# Altium schematic sheet CM5IO.SchDoc
size 297 x 209 mm
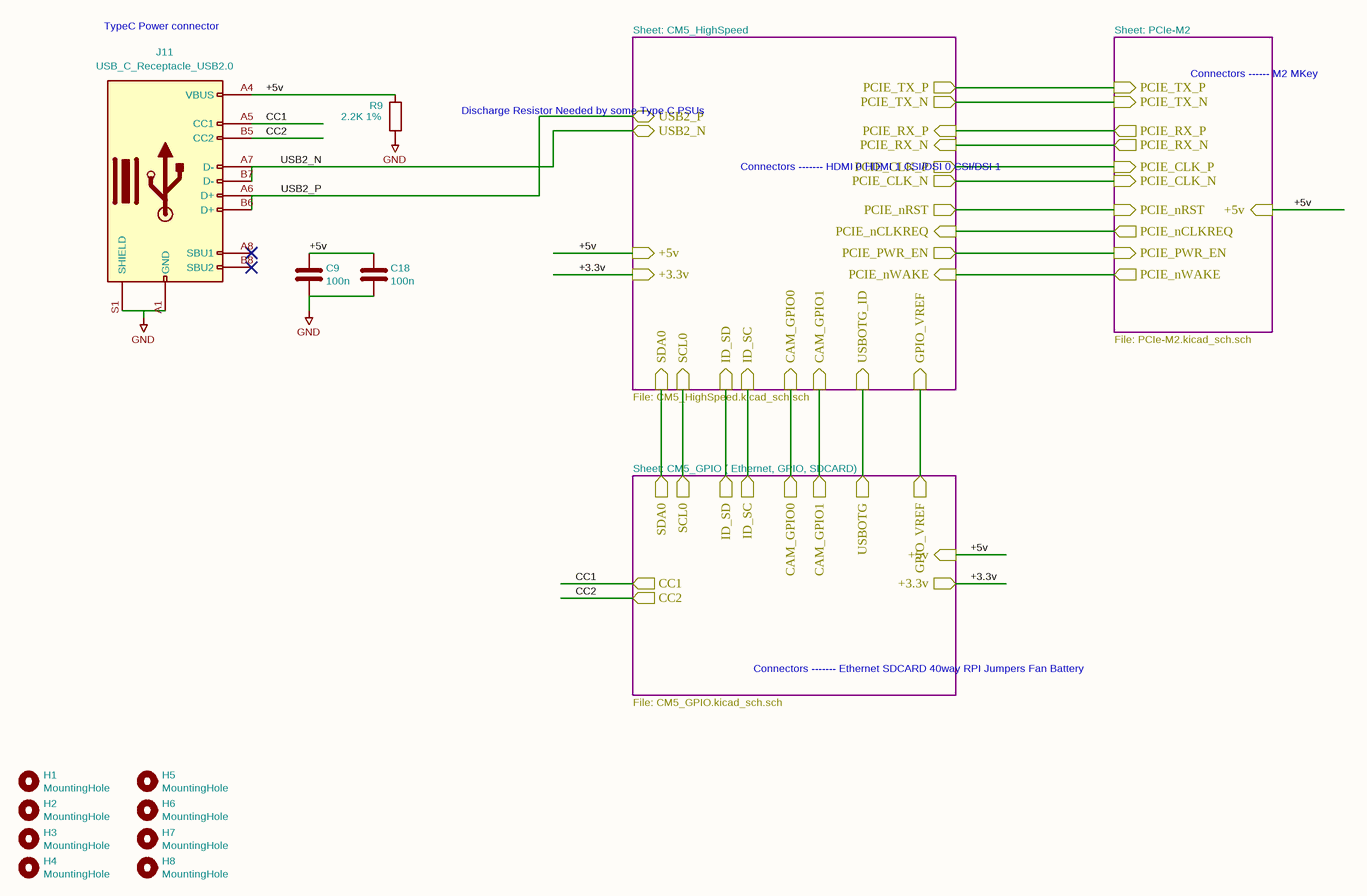
[diagram p0: CM5IO.SchDoc]

## Parts
C9  100n  [C_0402_1005Metric]
C18  100n  [C_0402_1005Metric]
H1  MountingHole  [MountingHole_2.7mm_M2.5_DIN965]
H2  MountingHole  [MountingHole_2.7mm_M2.5_DIN965]
H3  MountingHole  [MountingHole_2.7mm_M2.5_DIN965]
H4  MountingHole  [MountingHole_2.7mm_M2.5_DIN965]
H5  MountingHole  [MountingHole_2.7mm_M2.5_DIN965]
H6  MountingHole  [MountingHole_2.7mm_M2.5_DIN965]
H7  MountingHole  [MountingHole_2.7mm_M2.5_DIN965]
H8  MountingHole  [MountingHole_2.7mm_M2.5_DIN965]
J11  USB_C_Receptacle_USB2.0  [USB_C_Receptacle_GCT_USB4105-xx-A_16P_TopMnt_Horizontal]
R9  2.2K 1%  [R_0402_1005Metric]

## Sub-sheets
CM5_GPIO ( Ethernet, GPIO, SDCARD) = CM5_GPIO.SchDoc: ID_SC (out), ID_SD (out), SCL0 (out), SDA0 (out), +5v (in), +3.3v (out), GPIO_VREF (out), CAM_GPIO0 (out), CAM_GPIO1 (out), CC1 (out), USBOTG (out), CC2 (out)
CM5_HighSpeed = CM5_HighSpeed.SchDoc: USB2_N (bidir), USB2_P (bidir), ID_SC (in), ID_SD (in), SCL0 (in), SDA0 (in), +5v (in), PCIE_CLK_P (out), PCIE_CLK_N (out), PCIE_TX_P (out), PCIE_TX_N (out), PCIE_nRST (out), PCIE_RX_P (in), PCIE_RX_N (in), PCIE_nCLKREQ (in), +3.3v (in), USBOTG_ID (in), GPIO_VREF (in), PCIE_PWR_EN (out), PCIE_nWAKE (in), CAM_GPIO0 (in), CAM_GPIO1 (in)
PCIe-M2 = PCIe-M2.SchDoc: PCIE_CLK_P (in), PCIE_CLK_N (in), PCIE_TX_P (in), PCIE_TX_N (in), PCIE_nCLKREQ (out), PCIE_nRST (in), PCIE_RX_P (out), PCIE_RX_N (out), +5v (in), PCIE_PWR_EN (in), PCIE_nWAKE (out)

## Nets
GND: C9.2 C18.2 J11.A1(GND) J11.S1(SHIELD) R9.2
+3.3v: sheet CM5_GPIO ( Ethernet, GPIO, SDCARD)/+3.3v, sheet CM5_HighSpeed/+3.3v
+5v: C9.1 C18.1 J11.A4(VBUS) R9.1 ; sheet CM5_GPIO ( Ethernet, GPIO, SDCARD)/+5v, sheet CM5_HighSpeed/+5v, sheet PCIe-M2/+5v
CC1: J11.A5(CC1) ; sheet CM5_GPIO ( Ethernet, GPIO, SDCARD)/CC1
CC2: J11.B5(CC2) ; sheet CM5_GPIO ( Ethernet, GPIO, SDCARD)/CC2
USB2_N: J11.A7(D-) J11.B7(D-) ; sheet CM5_HighSpeed/USB2_N
USB2_P: J11.A6(D+) J11.B6(D+) ; sheet CM5_HighSpeed/USB2_P
(unnamed): sheet CM5_GPIO ( Ethernet, GPIO, SDCARD)/ID_SC, sheet CM5_HighSpeed/ID_SC
(unnamed): sheet CM5_GPIO ( Ethernet, GPIO, SDCARD)/ID_SD, sheet CM5_HighSpeed/ID_SD
(unnamed): sheet CM5_GPIO ( Ethernet, GPIO, SDCARD)/SCL0, sheet CM5_HighSpeed/SCL0
(unnamed): sheet CM5_GPIO ( Ethernet, GPIO, SDCARD)/SDA0, sheet CM5_HighSpeed/SDA0
(unnamed): sheet CM5_GPIO ( Ethernet, GPIO, SDCARD)/GPIO_VREF, sheet CM5_HighSpeed/GPIO_VREF
(unnamed): sheet CM5_GPIO ( Ethernet, GPIO, SDCARD)/CAM_GPIO0, sheet CM5_HighSpeed/CAM_GPIO0
(unnamed): sheet CM5_GPIO ( Ethernet, GPIO, SDCARD)/CAM_GPIO1, sheet CM5_HighSpeed/CAM_GPIO1
(unnamed): sheet CM5_GPIO ( Ethernet, GPIO, SDCARD)/USBOTG, sheet CM5_HighSpeed/USBOTG_ID
(unnamed): sheet CM5_HighSpeed/PCIE_CLK_P, sheet PCIe-M2/PCIE_CLK_P
(unnamed): sheet CM5_HighSpeed/PCIE_CLK_N, sheet PCIe-M2/PCIE_CLK_N
(unnamed): sheet CM5_HighSpeed/PCIE_TX_P, sheet PCIe-M2/PCIE_TX_P
(unnamed): sheet CM5_HighSpeed/PCIE_TX_N, sheet PCIe-M2/PCIE_TX_N
(unnamed): sheet CM5_HighSpeed/PCIE_nRST, sheet PCIe-M2/PCIE_nRST
(unnamed): sheet CM5_HighSpeed/PCIE_RX_P, sheet PCIe-M2/PCIE_RX_P
(unnamed): sheet CM5_HighSpeed/PCIE_RX_N, sheet PCIe-M2/PCIE_RX_N
(unnamed): sheet CM5_HighSpeed/PCIE_nCLKREQ, sheet PCIe-M2/PCIE_nCLKREQ
(unnamed): sheet CM5_HighSpeed/PCIE_PWR_EN, sheet PCIe-M2/PCIE_PWR_EN
(unnamed): sheet CM5_HighSpeed/PCIE_nWAKE, sheet PCIe-M2/PCIE_nWAKE

Not connected (* = marked no-connect by the designer): J11 A8(SBU1)* A9(VBUS) A12(GND) B1(GND) B4(VBUS) B8(SBU2)* B9(VBUS) B12(GND)

## Notes on the sheet
- TypeC Power connector
- Sheet: CM5_HighSpeed
- Sheet: PCIe-M2
- Discharge Resistor
  Needed by some
  Type C PSUs
- Connectors
  ------
  M2 MKey
- Connectors
  -------
  HDMI 0
  HDMI 1
  CSI/DSI 0
  CSI/DSI 1
- File: PCIe-M2.kicad_sch.sch
- File: CM5_HighSpeed.kicad_sch.sch
- Sheet: CM5_GPIO ( Ethernet, GPIO, SDCARD)
- File: CM5_GPIO.kicad_sch.sch
- Connectors
  -------
  Ethernet
  SDCARD
  40way RPI
  Jumpers
  Fan
  Battery
- 1
- 2
- 3
- 4
- 5
- 6
- A
- B
- C
- www.raspberrypi.com <http://www.raspberrypi.com>
- D
- Title: Compute Module 5 IO Board - Top Level
- File: CM5IO.kicad_sch
- Sheet: /
- Copyright © 2024 Raspberry Pi Ltd.
- KiCad E.D.A.  kicad (5.1.4)-1
- Size: A4
- Date:
- Rev: 1
- Id: 1/1

## Library data of the parts
C9 C18 = C: Part Description: 0.1uF 10% 16V Ceramic Capacitor X7R 0402 (1005 Metric); Field4: Farnell; Field5: 2611911; Field6: RM EMK105 B7104KV-F; Field7: TAIYO YUDEN EUROPE GMBH; Field8: 110091611; Value: 100n; Footprint: Capacitor_SMD:C_0402_1005Metric
H1-H8 = MountingHole: Part Description: M2.5 mounting hole; Field4: nf; Field5: nf; Field6: nf; Field7: nf; Value: MountingHole; Footprint: CM5IO:MountingHole_2.7mm_M2.5_DIN965
J11 = USB_C_Receptacle_USB2.0_16P: Part Description: USBC USB2 data and power connector; Field5: USBF31-0171; Field7: MTCONN; Field6: USBF31-0171; Value: USB_C_Receptacle_USB2.0; Footprint: Connector_USB:USB_C_Receptacle_GCT_USB4105-xx-A_16P_TopMnt_Horizontal
R9 = R: Part Description: Resistor 2.2K M1005 1% 63mW; Field4: Farnell; Value: 2.2K 1%; Footprint: Resistor_SMD:R_0402_1005Metric